# Altium schematic sheet 03.LemonAutopilot_3.SchDoc
size A4
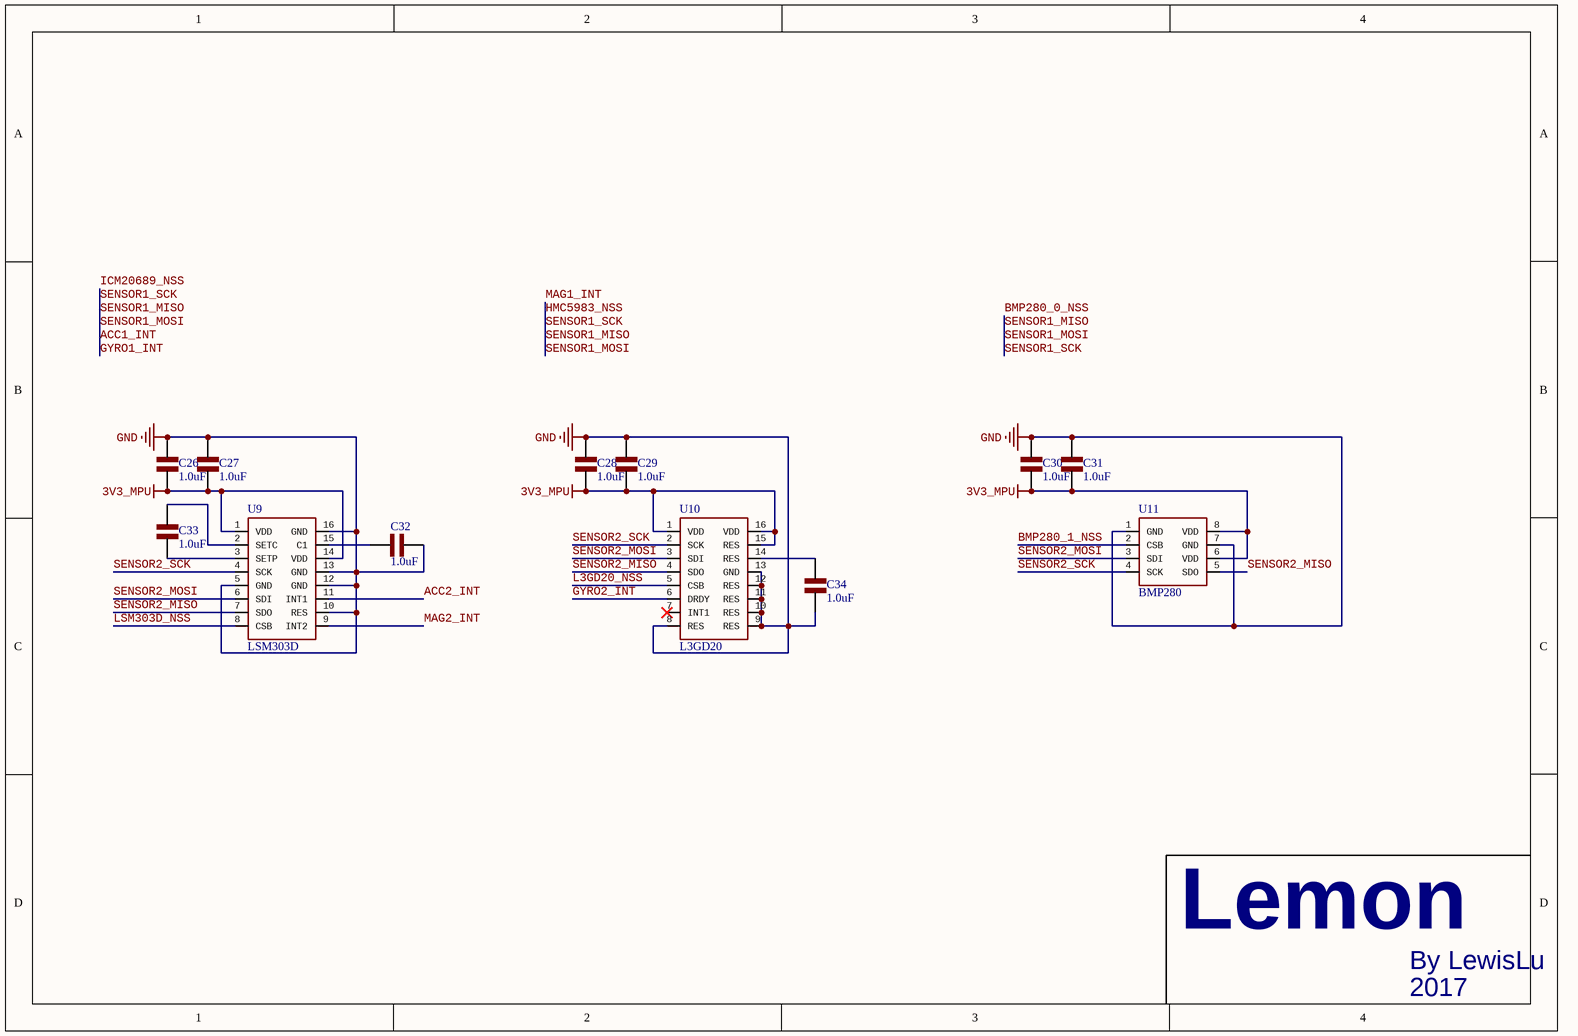
[diagram p0: 03.LemonAutopilot_3.SchDoc]

## Parts
C26  1.0uF  [0603_C]
C27  1.0uF  [0603_C]
C28  1.0uF  [0603_C]
C29  1.0uF  [0603_C]
C30  1.0uF  [0603_C]
C31  1.0uF  [0603_C]
C32  1.0uF  [0603_C]
C33  1.0uF  [0603_C]
C34  1.0uF  [0603_C]
U9  LSM303D
U10  L3GD20
U11  BMP280

## Nets
3V3_MPU: C26.1 C27.1 C28.1 C29.1 C30.2 C31.2 U9.1(VDD) U9.14(VDD) U10.1(VDD) U10.15(RES) U10.16(VDD) U11.6(VDD) U11.8(VDD)
GND: C26.2 C27.2 C28.2 C29.2 C30.1 C31.1 C32.1 C34.1 U9.5(GND) U9.10(RES) U9.12(GND) U9.13(GND) U9.16(GND) U10.8(RES) U10.9(RES) U10.10(RES) U10.11(RES) U10.12(RES) U10.13(GND) U11.1(GND) U11.7(GND)
ACC2_INT: U9.11(INT1)
BMP280_1_NSS: U11.2(CSB)
GYRO2_INT: U10.6(DRDY)
L3GD20_NSS: U10.5(CSB)
LSM303D_NSS: U9.8(CSB)
MAG2_INT: U9.9(INT2)
SENSOR2_MISO: U9.7(SDO) U10.4(SDO) U11.5(SDO)
SENSOR2_MOSI: U9.6(SDI) U10.3(SDI) U11.3(SDI)
SENSOR2_SCK: U9.4(SCK) U10.2(SCK) U11.4(SCK)
NetC32_2: C32.2 U9.15(C1)
NetC33_1: C33.1 U9.3(SETP)
NetC33_2: C33.2 U9.2(SETC)
NetC34_2: C34.2 U10.14(RES)

Not connected (* = marked no-connect by the designer): U10 7(INT1)*

## Notes on the sheet
- Lemon
- By LewisLu
- 2017

## Library data of the parts
C26-C34 = C0603